# Altium schematic sheet SdCard.SchDoc
size A4; SheetNumber: 6; SheetTotal: 6
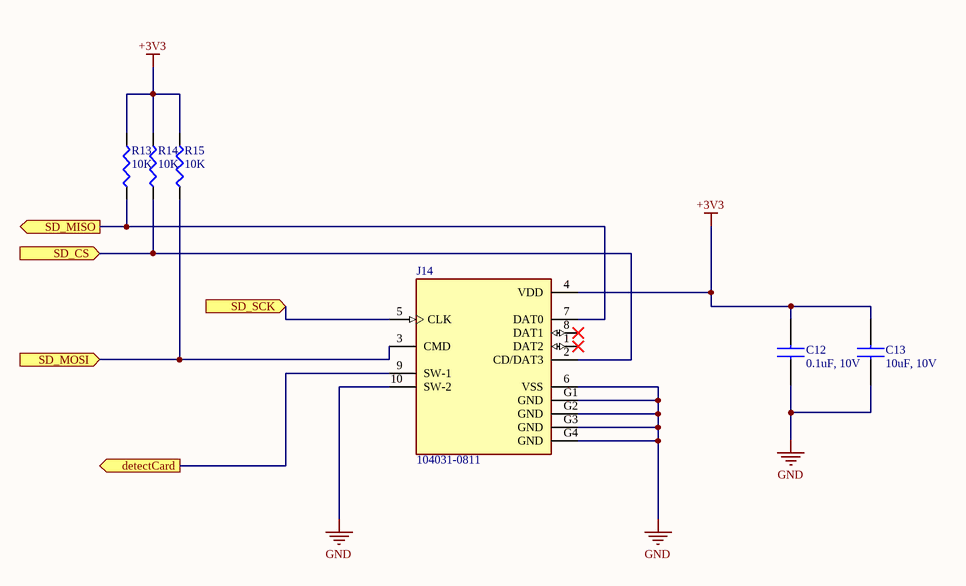
[diagram p0: SdCard.SchDoc]

## Parts
C12  0.1uF, 10V  [CAPC1608X90N]
C13  10uF, 10V  [CAPC1608X90N]
J14  104031-0811  [MOLEX_104031-0811]
R13  10K  [RESC1607X60N]
R14  10K  [RESC1607X60N]
R15  10K  [RESC1607X60N]

## Ports
detectCard (out), SD_CS (in), SD_MISO (out), SD_MOSI (in), SD_SCK (in)

## Nets
+3V3: C12.2 C13.2 J14.4(VDD) R13.2 R14.2 R15.2
GND: C12.1 C13.1 J14.6(VSS) J14.10(SW-2) J14.G1(GND) J14.G2(GND) J14.G3(GND) J14.G4(GND)
detectCard: J14.9(SW-1) ; port detectCard
SD_CS: J14.2(CD/DAT3) R14.1 ; port SD_CS
SD_MISO: J14.7(DAT0) R13.1 ; port SD_MISO
SD_MOSI: J14.3(CMD) R15.1 ; port SD_MOSI
SD_SCK: J14.5(CLK) ; port SD_SCK

Not connected (* = marked no-connect by the designer): J14 1(DAT2)* 8(DAT1)*

## Library data of the parts
C12 = C0603C104K8RACTU: CAP CER 0.1UF 10V X7R 0603; Manufacturer_Name: KEMET; Datasheet Link: https://componentsearchengine.com/Datasheets/2/CL10A106MP8NNNC.pdf; Height: 0.9mm; Manufacturer_Part_Number: C0603C104K8RACTU; Mouser Part Number: 187-CL10A106MP8NNNC; Mouser Price/Stock: https://www.mouser.co.uk/ProductDetail/Samsung-Electro-Mechanics/CL10A106MP8NNNC?qs=X6jEic%2FHinAgjcVTZfg7UA%3D%3D; Arrow Part Number: CL10A106MP8NNNC; Arrow Price/Stock: https://www.arrow.com/en/products/cl10a106mp8nnnc/samsung-electro-mechanics?utm_currency=USD&region=europe
C13 = CL10A106MP8NNNC: CAP CER 10UF 10V X5R 0603; Manufacturer_Name: SAMSUNG; Datasheet Link: https://componentsearchengine.com/Datasheets/2/CL10A106MP8NNNC.pdf; Height: 0.9mm; Manufacturer_Part_Number: CL10A106MP8NNNC; Mouser Part Number: 187-CL10A106MP8NNNC; Mouser Price/Stock: https://www.mouser.co.uk/ProductDetail/Samsung-Electro-Mechanics/CL10A106MP8NNNC?qs=X6jEic%2FHinAgjcVTZfg7UA%3D%3D; Arrow Part Number: CL10A106MP8NNNC; Arrow Price/Stock: https://www.arrow.com/en/products/cl10a106mp8nnnc/samsung-electro-mechanics?utm_currency=USD&region=europe
J14 = 104031-0811: Surface Mount Micro SD Card Connector, with Push In Termination | Molex Incorporated 104031-0811; SnapEDA_Link: https://www.snapeda.com/parts/104031-0811/Molex/view-part/?ref=snap; Package: None; Value: *; MF: Molex; MP: 104031-0811; Check_prices: https://www.snapeda.com/parts/104031-0811/Molex/view-part/?ref=eda
R13-R15 = RC0603JR-0710KL: RES 10K OHM 5% 1/10W 0603; Manufacturer: Yageo; Resistance: 10kR; Temperature Coefficient: 100ppm/°C; Voltage Rating (AC): 50V; Max Power Dissipation: 100mW; Supplier 1: Digikey; Manufacturer Part Number: RC0603JR-0710KL; RoHS: Yes; Category: Chip SMD Resistors; Stock 1: 50431; Pricing 1: 1=0,1, 10=0,008, 50=0,0072, 100=0,0061, 500=0,0051 (USD); Case/Package: 0603; Min Operating Temperature: -55°C; Max Operating Temperature: 155°C; Tolerance: 5%; Number of Terminations: 2; Series: RC; Reach SVHC Compliant: 4187SVHC; Lead Free: 5697LeadFree; RoHS Compliant: Yes; ComponentLink1URL: https://datasheet.ciiva.com/2452/pyu-rc-group-51-rohs-l-10-2452848.pdf?src-supplier=Digikey; ComponentLink1Description: https://datasheet.ciiva.com/2452/pyu-rc-group-51-rohs-l-10-2452848.pdf?src-supplier=Digikey